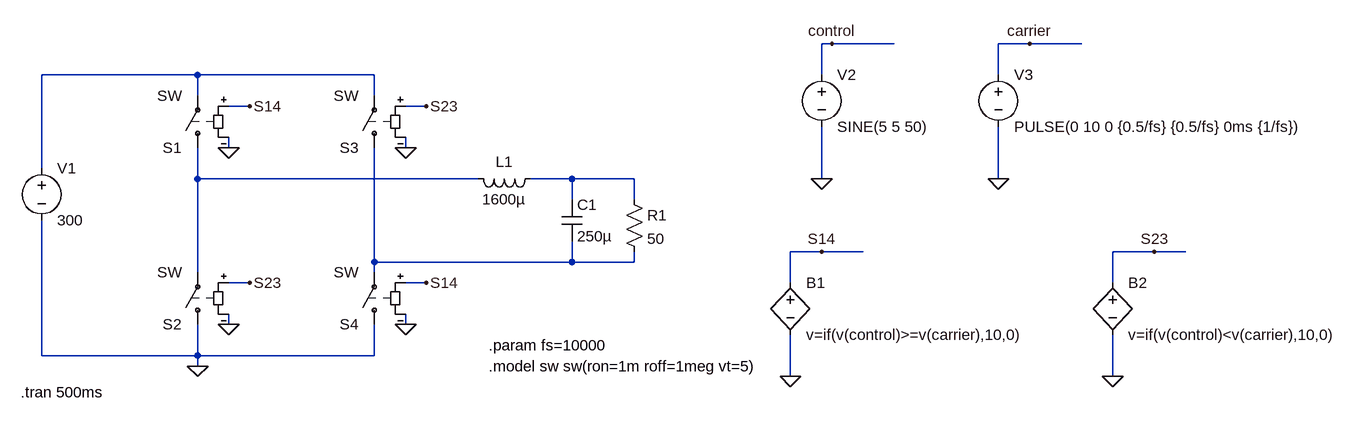
[diagram p0: schematic Single phase dc-ac converter.asc]
Single phase dc-ac converter.asc, the LTspice schematic file:
Version 4
SHEET 1 2028 680
WIRE 1200 -192 1184 -192
WIRE 1296 -192 1200 -192
WIRE 1504 -192 1456 -192
WIRE 1584 -192 1504 -192
WIRE 224 -144 -16 -144
WIRE 496 -144 224 -144
WIRE 1184 -144 1184 -192
WIRE 1456 -144 1456 -192
WIRE 224 -112 224 -144
WIRE 496 -112 496 -144
WIRE 304 -96 272 -96
WIRE 576 -96 544 -96
WIRE 272 -32 272 -48
WIRE 544 -32 544 -48
WIRE -16 0 -16 -144
WIRE 224 16 224 -32
WIRE 656 16 224 16
WIRE 800 16 736 16
WIRE 896 16 800 16
WIRE 1184 16 1184 -64
WIRE 1456 16 1456 -64
WIRE 800 48 800 16
WIRE 896 48 896 16
WIRE 1184 128 1136 128
WIRE 1248 128 1184 128
WIRE 1696 128 1632 128
WIRE 1744 128 1696 128
WIRE 496 144 496 -32
WIRE 800 144 800 112
WIRE 800 144 496 144
WIRE 896 144 896 128
WIRE 896 144 800 144
WIRE 224 160 224 16
WIRE 496 160 496 144
WIRE 304 176 272 176
WIRE 576 176 544 176
WIRE 1136 176 1136 128
WIRE 1632 176 1632 128
WIRE 272 240 272 224
WIRE 544 240 544 224
WIRE -16 288 -16 80
WIRE 224 288 224 240
WIRE 224 288 -16 288
WIRE 496 288 496 240
WIRE 496 288 224 288
WIRE 224 304 224 288
WIRE 1136 320 1136 256
WIRE 1632 320 1632 256
FLAG 224 304 0
FLAG 272 -32 0
FLAG 544 -32 0
FLAG 544 240 0
FLAG 272 240 0
FLAG 304 -96 S14
FLAG 576 176 S14
FLAG 576 -96 S23
FLAG 304 176 S23
FLAG 1184 16 0
FLAG 1456 16 0
FLAG 1200 -192 control
FLAG 1504 -192 carrier
FLAG 1136 320 0
FLAG 1632 320 0
FLAG 1184 128 S14
FLAG 1696 128 S23
SYMBOL voltage -16 -16 R0
WINDOW 123 0 0 Left 0
WINDOW 39 0 0 Left 0
SYMATTR InstName V1
SYMATTR Value 300
SYMBOL sw 224 -16 R180
SYMATTR InstName S1
SYMBOL sw 224 256 R180
SYMATTR InstName S2
SYMBOL sw 496 -16 R180
SYMATTR InstName S3
SYMBOL sw 496 256 R180
SYMATTR InstName S4
SYMBOL ind 752 0 R90
WINDOW 0 5 56 VBottom 2
WINDOW 3 32 56 VTop 2
SYMATTR InstName L1
SYMATTR Value 1600µ
SYMATTR SpiceLine Ipk=200m
SYMBOL cap 784 48 R0
SYMATTR InstName C1
SYMATTR Value 250µ
SYMATTR SpiceLine V=100m
SYMBOL res 880 32 R0
SYMATTR InstName R1
SYMATTR Value 50
SYMBOL voltage 1184 -160 R0
WINDOW 123 0 0 Left 0
WINDOW 39 0 0 Left 0
SYMATTR InstName V2
SYMATTR Value SINE(5 5 50)
SYMBOL voltage 1456 -160 R0
WINDOW 123 0 0 Left 0
WINDOW 39 0 0 Left 0
SYMATTR InstName V3
SYMATTR Value PULSE(0 10 0 {0.5/fs} {0.5/fs} 0ms {1/fs})
SYMBOL bv 1136 160 R0
SYMATTR InstName B1
SYMATTR Value v=if(v(control)>=v(carrier),10,0)
SYMBOL bv 1632 160 R0
SYMATTR InstName B2
SYMATTR Value v=if(v(control)<v(carrier),10,0)
TEXT 672 272 Left 2 !.param fs=10000
TEXT 672 304 Left 2 !.model sw sw(ron=1m roff=1meg vt=5)
TEXT -48 344 Left 2 !.tran 500ms

The netlist it stands for:
* Single phase dc-ac converter.asc
V1 N001 0 300
S1 N002 N001 S14 0 SW
S2 0 N002 S23 0 SW
S3 N004 N001 S23 0 SW
S4 0 N004 S14 0 SW
L1 N003 N002 1600µ Ipk=200m
C1 N003 N004 250µ V=100m
R1 N003 N004 50
V2 control 0 SINE(5 5 50)
V3 carrier 0 PULSE(0 10 0 {0.5/fs} {0.5/fs} 0ms {1/fs})
B1 S14 0 v=if(v(control)>=v(carrier),10,0)
B2 S23 0 v=if(v(control)<v(carrier),10,0)
.param fs=10000
.model sw sw(ron=1m roff=1meg vt=5)
.tran 500ms
.backanno
.end